# EAGLE schematic template_sensorboard (EAGLE 7.2.0)
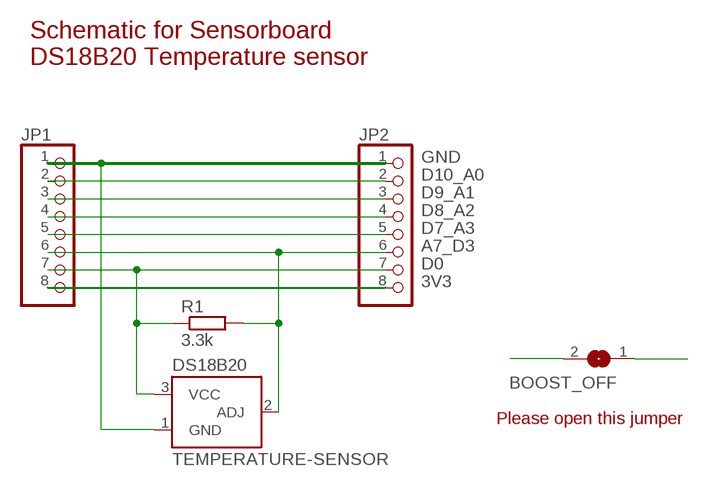
[diagram p0: schematic, sheet 1]

## Parts
BOOST_OFF  SJ  [SJ]
DS18B20  TEMPERATURE-SENSOR  [TO-92]
JP1  PINHD-1X8  [1X08]
JP2  PINHD-1X8  [1X08]
R1  3.3k  R-EU_0207/15  [0207/15]

## Nets
3V3: JP1.8 JP2.8
A7_D3: DS18B20.2(ADJ) JP1.6 JP2.6 R1.2
D0: DS18B20.3(VCC) JP1.7 JP2.7 R1.1
D7_A3: JP1.5 JP2.5
D8_A2: JP1.4 JP2.4
D9_A1: JP1.3 JP2.3
D10_A0: JP1.2 JP2.2
GND: DS18B20.1(GND) JP1.1 JP2.1
N$1: BOOST_OFF.2
N$2: BOOST_OFF.1

## Notes on the sheet
- Schematic for Sensorboard
  DS18B20 Temperature sensor
- Please open this jumper

## Library data of the parts
BOOST_OFF = jumper:SJ: SMD solder JUMPER
DS18B20 = SparkFun-Sensors:TEMPERATURE-SENSOR: TO-92 temp sensor
JP1 JP2 = pinhead:PINHD-1X8: PIN HEADER
R1 = rcl:R-EU_: RESISTOR, European symbol